# Altium schematic sheet ArbPwrBoost_P1.SchDoc: =ProjectTitle
size B; Engineer: Hab S Collector; Address1: 3621 Gin Way; Address2: Snellville GA, 30039; SheetNumber: 1; SheetTotal: 8
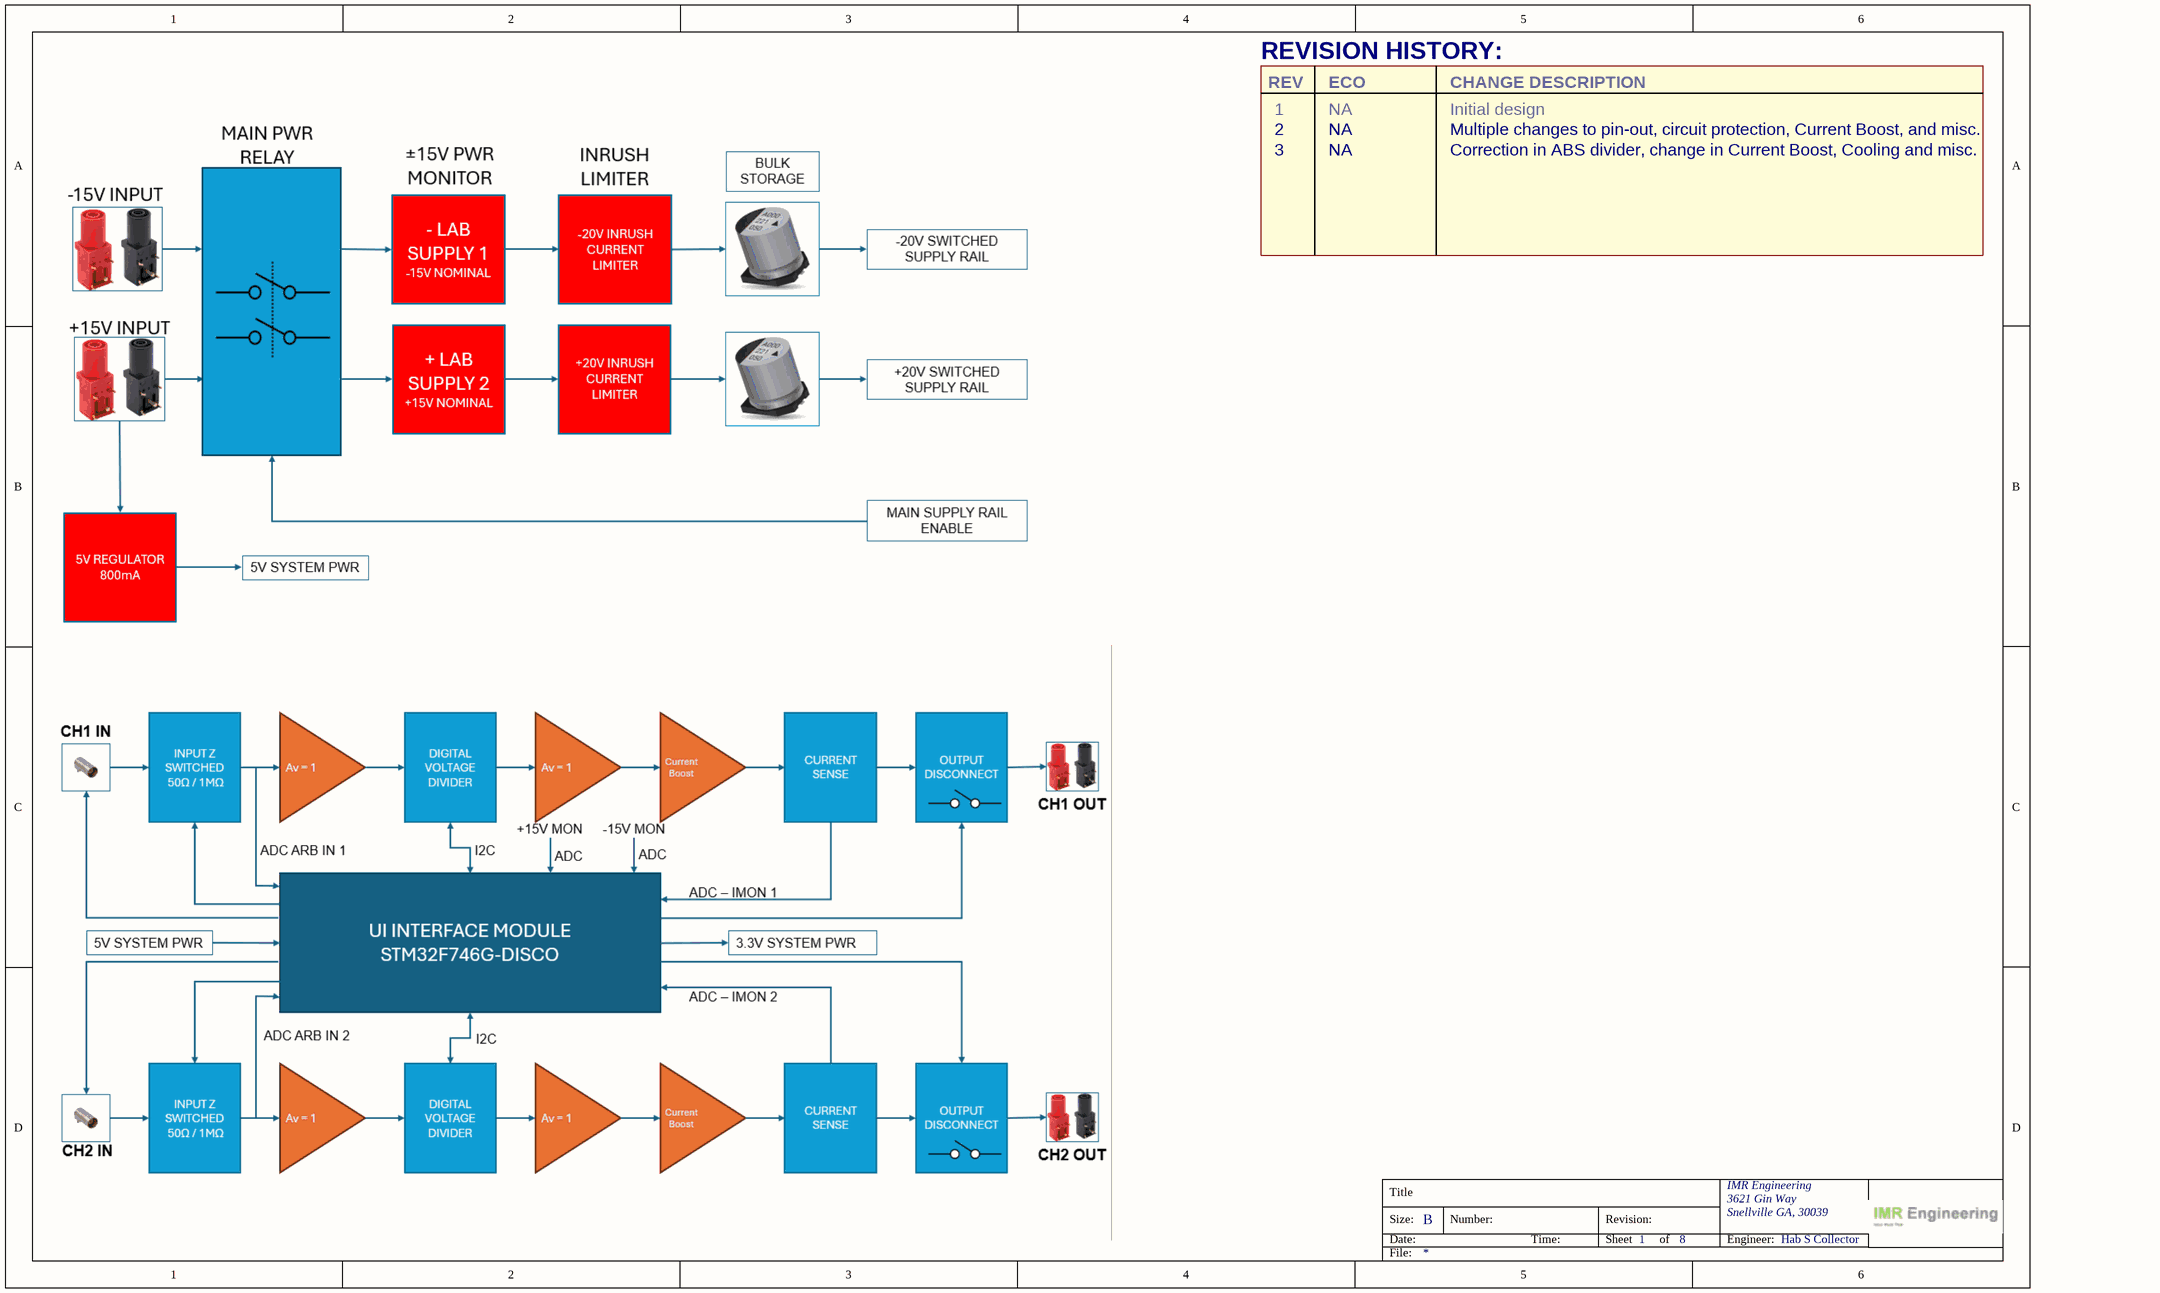
[diagram p0: ArbPwrBoost_P1.SchDoc]

## Notes on the sheet
- REVISION HISTORY:
- REV
- ECO
- CHANGE DESCRIPTION
- 1
- 2
- 3
- NA
- Initial design
- Multiple changes to pin-out, circuit protection, Current Boost, and misc.
- Correction in ABS divider, change in Current Boost, Cooling and misc.
- Title
- Size:
- Date:
- B
- Number:
- Time:
- Revision:
- Sheet
- of
- IMR Engineering
- Engineer:
- File: